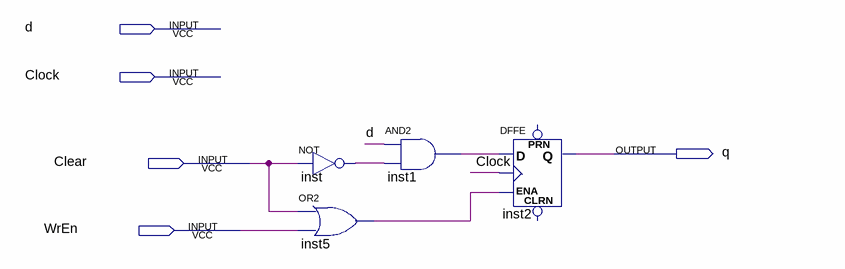
[diagram p0: schematic sheet]
// Quartus schematic dffeSyncCLR.bdf as structural Verilog: 4 symbols, 5 pins
module dffeSyncCLR (
  input  d,
  input  Clock,
  input  Clear,
  input  WrEn,
  output q
);

  wire inst1_out, inst5_out, inst_out;

  not inst (inst_out, Clear);
  or inst5 (inst5_out, Clear, WrEn);
  and inst1 (inst1_out, d, inst_out);
  DFFE inst2 (.D(inst1_out), .CLK(Clock), .ENA(inst5_out), .Q(q));  // open: PRN, CLRN
endmodule
